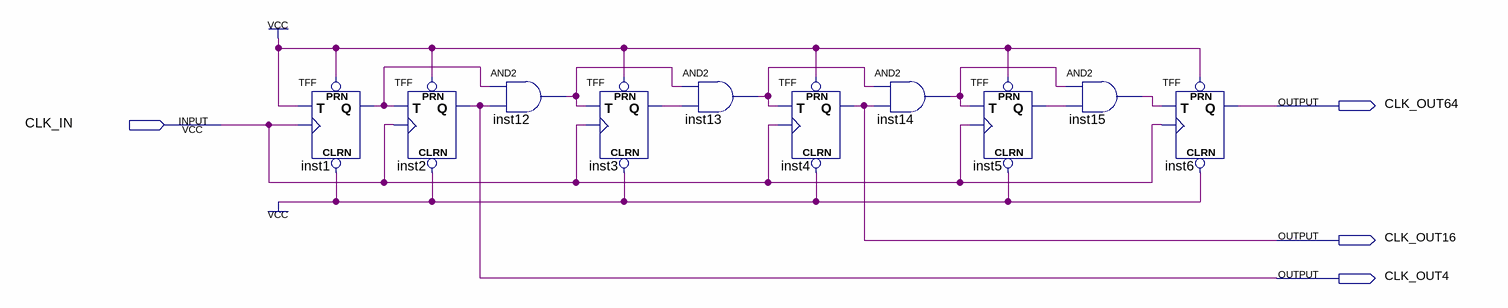
[diagram p0: schematic sheet]
// Quartus schematic Clock_divider_4_16_and_64.bdf as structural Verilog: 10 symbols, 4 pins
module Clock_divider_4_16_and_64 (
  input  CLK_IN,
  output CLK_OUT64,
  output CLK_OUT16,
  output CLK_OUT4
);

  wire inst1_q, inst3_q, inst5_q, inst12_out, inst13_out, inst14_out, inst15_out;

  TFF inst1 (.PRN(1'b1), .CLRN(1'b1), .T(1'b1), .CLK(CLK_IN), .Q(inst1_q));
  TFF inst2 (.PRN(1'b1), .CLRN(1'b1), .T(inst1_q), .CLK(CLK_IN), .Q(CLK_OUT4));
  and inst12 (inst12_out, inst1_q, CLK_OUT4);
  TFF inst3 (.PRN(1'b1), .CLRN(1'b1), .T(inst12_out), .CLK(CLK_IN), .Q(inst3_q));
  and inst13 (inst13_out, inst12_out, inst3_q);
  TFF inst4 (.PRN(1'b1), .CLRN(1'b1), .T(inst13_out), .CLK(CLK_IN), .Q(CLK_OUT16));
  and inst14 (inst14_out, inst13_out, CLK_OUT16);
  TFF inst5 (.PRN(1'b1), .CLRN(1'b1), .T(inst14_out), .CLK(CLK_IN), .Q(inst5_q));
  and inst15 (inst15_out, inst14_out, inst5_q);
  TFF inst6 (.PRN(1'b1), .CLRN(1'b1), .T(inst15_out), .CLK(CLK_IN), .Q(CLK_OUT64));
endmodule
